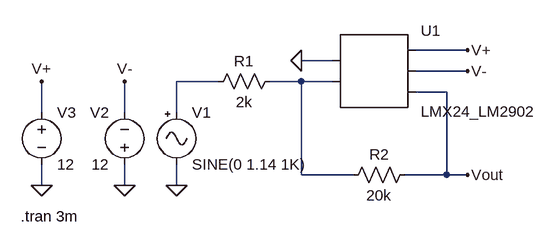
[diagram p0: schematic LMX24.asc]
LMX24.asc, the LTspice schematic file:
Version 4
SHEET 1 880 680
WIRE 384 144 304 144
WIRE 176 160 128 160
WIRE 384 176 304 176
WIRE 0 192 -64 192
WIRE 128 192 80 192
WIRE 176 192 128 192
WIRE 352 208 304 208
WIRE -272 240 -272 192
WIRE -144 240 -144 192
WIRE -64 240 -64 192
WIRE 128 336 128 192
WIRE 208 336 128 336
WIRE 352 336 352 208
WIRE 352 336 288 336
WIRE 384 336 352 336
WIRE -272 352 -272 320
WIRE -144 352 -144 320
WIRE -64 352 -64 320
FLAG 128 160 0
FLAG 384 336 Vout
FLAG 384 144 V+
FLAG 384 176 V-
FLAG -64 352 0
FLAG -144 352 0
FLAG -272 352 0
FLAG -144 192 V-
FLAG -272 192 V+
SYMBOL AutoGenerated\\LMX24_LM2902 240 176 R0
SYMATTR InstName U1
SYMBOL res 96 176 R90
WINDOW 0 0 56 VBottom 2
WINDOW 3 32 56 VTop 2
SYMATTR InstName R1
SYMATTR Value 2k
SYMBOL res 304 320 R90
WINDOW 0 0 56 VBottom 2
WINDOW 3 32 56 VTop 2
SYMATTR InstName R2
SYMATTR Value 20k
SYMBOL Misc\\signal -64 224 R0
WINDOW 123 0 0 Left 0
WINDOW 39 0 0 Left 0
SYMATTR InstName V1
SYMATTR Value SINE(0 1.14 1K)
SYMBOL voltage -144 336 R180
WINDOW 0 24 96 Left 2
WINDOW 3 24 16 Left 2
WINDOW 123 0 0 Left 0
WINDOW 39 0 0 Left 0
SYMATTR InstName V2
SYMATTR Value 12
SYMBOL voltage -272 224 R0
WINDOW 123 0 0 Left 0
WINDOW 39 0 0 Left 0
SYMATTR InstName V3
SYMATTR Value 12
TEXT -304 400 Left 2 !.tran 3m

The netlist it stands for:
* LMX24.asc
* U1: LMX24_LM2902 (symbol AutoGenerated\LMX24_LM2902 not available, pins judged from their places): pin1=0 pin2=N002 pin3=V+ pin4=V- pin5=Vout
R1 N002 N001 2k
R2 Vout N002 20k
V1 N001 0 SINE(0 1.14 1K)
V2 0 V- 12
V3 V+ 0 12
.tran 3m
.backanno
.end